# Altium schematic sheet sDAC_filters_1.SchDoc
size A; SheetNumber: 22; SheetTotal: 24
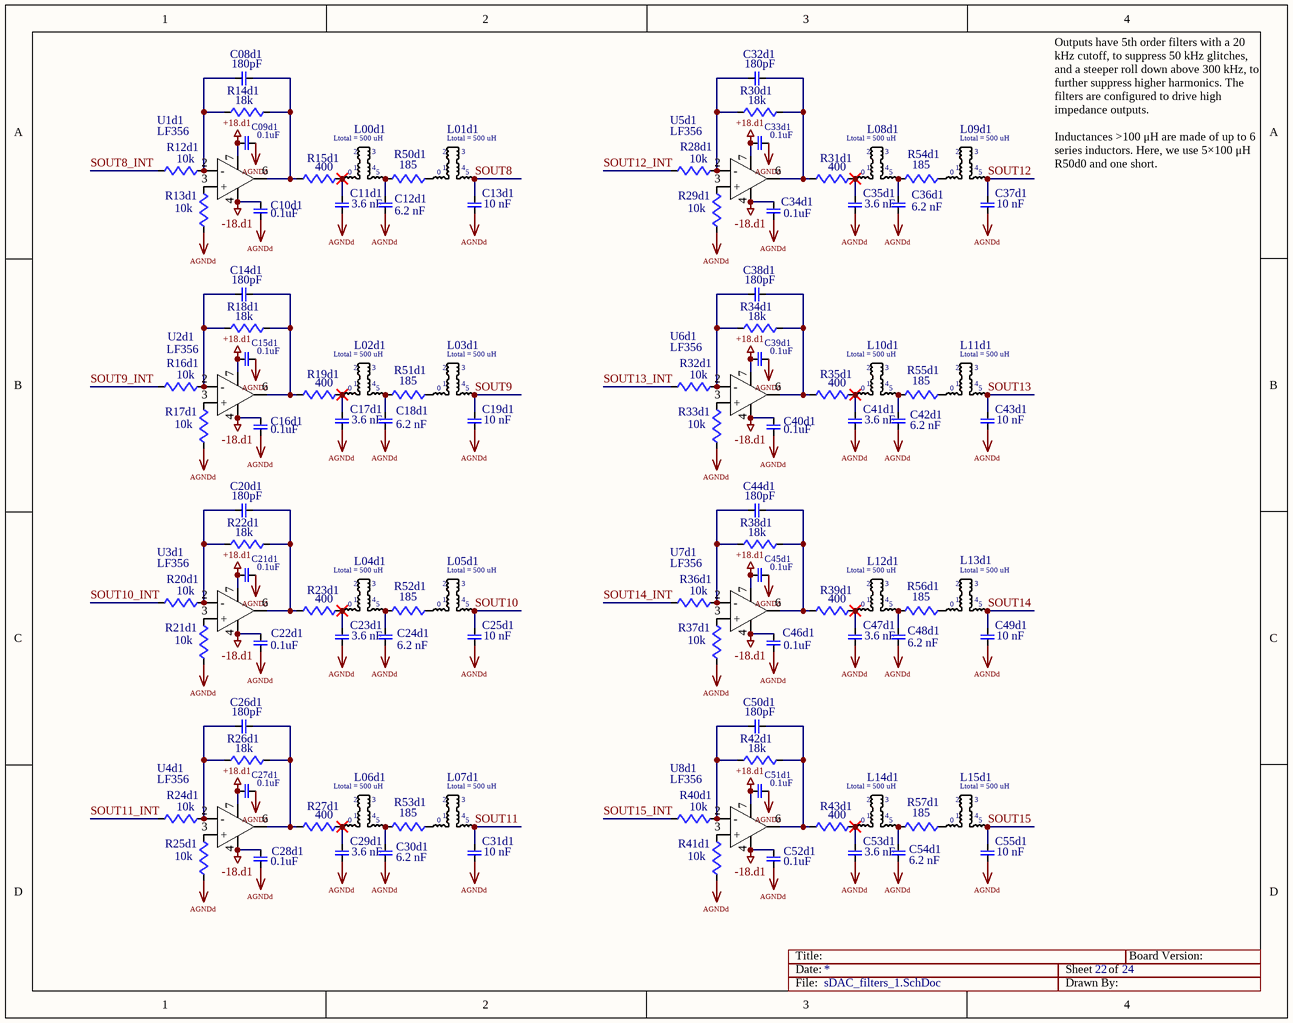
[diagram p0: sDAC_filters_1.SchDoc]

## Parts
C08d1  180pF  [0603]
C09d1  0.1uF  [0603]
C10d1  0.1uF  [0603]
C11d1  3.6 nF  [0603]
C12d1  6.2 nF  [0603]
C13d1  10 nF  [0603]
C14d1  180pF  [0603]
C15d1  0.1uF  [0603]
C16d1  0.1uF  [0603]
C17d1  3.6 nF  [0603]
C18d1  6.2 nF  [0603]
C19d1  10 nF  [0603]
C20d1  180pF  [0603]
C21d1  0.1uF  [0603]
C22d1  0.1uF  [0603]
C23d1  3.6 nF  [0603]
C24d1  6.2 nF  [0603]
C25d1  10 nF  [0603]
C26d1  180pF  [0603]
C27d1  0.1uF  [0603]
C28d1  0.1uF  [0603]
C29d1  3.6 nF  [0603]
C30d1  6.2 nF  [0603]
C31d1  10 nF  [0603]
C32d1  180pF  [0603]
C33d1  0.1uF  [0603]
C34d1  0.1uF  [0603]
C35d1  3.6 nF  [0603]
C36d1  6.2 nF  [0603]
C37d1  10 nF  [0603]
C38d1  180pF  [0603]
C39d1  0.1uF  [0603]
C40d1  0.1uF  [0603]
C41d1  3.6 nF  [0603]
C42d1  6.2 nF  [0603]
C43d1  10 nF  [0603]
C44d1  180pF  [0603]
C45d1  0.1uF  [0603]
C46d1  0.1uF  [0603]
C47d1  3.6 nF  [0603]
C48d1  6.2 nF  [0603]
C49d1  10 nF  [0603]
C50d1  180pF  [0603]
C51d1  0.1uF  [0603]
C52d1  0.1uF  [0603]
C53d1  3.6 nF  [0603]
C54d1  6.2 nF  [0603]
C55d1  10 nF  [0603]
L00d1  Ltotal = 500 uH  [SMT_TOROID_2SIDE]
L01d1  Ltotal = 500 uH  [SMT_TOROID_2SIDE]
L02d1  Ltotal = 500 uH  [SMT_TOROID_2SIDE]
L03d1  Ltotal = 500 uH  [SMT_TOROID_2SIDE]
L04d1  Ltotal = 500 uH  [SMT_TOROID_2SIDE]
L05d1  Ltotal = 500 uH  [SMT_TOROID_2SIDE]
L06d1  Ltotal = 500 uH  [SMT_TOROID_2SIDE]
L07d1  Ltotal = 500 uH  [SMT_TOROID_2SIDE]
L08d1  Ltotal = 500 uH  [SMT_TOROID_2SIDE]
L09d1  Ltotal = 500 uH  [SMT_TOROID_2SIDE]
L10d1  Ltotal = 500 uH  [SMT_TOROID_2SIDE]
L11d1  Ltotal = 500 uH  [SMT_TOROID_2SIDE]
L12d1  Ltotal = 500 uH  [SMT_TOROID_2SIDE]
L13d1  Ltotal = 500 uH  [SMT_TOROID_2SIDE]
L14d1  Ltotal = 500 uH  [SMT_TOROID_2SIDE]
L15d1  Ltotal = 500 uH  [SMT_TOROID_2SIDE]
R12d1  10k  [0603]
R13d1  10k  [0603]
R14d1  18k  [0603]
R15d1  400  [0603]
R16d1  10k  [0603]
R17d1  10k  [0603]
R18d1  18k  [0603]
R19d1  400  [0603]
R20d1  10k  [0603]
R21d1  10k  [0603]
R22d1  18k  [0603]
R23d1  400  [0603]
R24d1  10k  [0603]
R25d1  10k  [0603]
R26d1  18k  [0603]
R27d1  400  [0603]
R28d1  10k  [0603]
R29d1  10k  [0603]
R30d1  18k  [0603]
R31d1  400  [0603]
R32d1  10k  [0603]
R33d1  10k  [0603]
R34d1  18k  [0603]
R35d1  400  [0603]
R36d1  10k  [0603]
R37d1  10k  [0603]
R38d1  18k  [0603]
R39d1  400  [0603]
R40d1  10k  [0603]
R41d1  10k  [0603]
R42d1  18k  [0603]
R43d1  400  [0603]
R50d1  185  [0603]
R51d1  185  [0603]
R52d1  185  [0603]
R53d1  185  [0603]
R54d1  185  [0603]
R55d1  185  [0603]
R56d1  185  [0603]
R57d1  185  [0603]
U1d1  LF356  [8SOIC]
U2d1  LF356  [8SOIC]
U3d1  LF356  [8SOIC]
U4d1  LF356  [8SOIC]
U5d1  LF356  [8SOIC]
U6d1  LF356  [8SOIC]
U7d1  LF356  [8SOIC]
U8d1  LF356  [8SOIC]

## Nets
+18.d1: C09d1.1 C15d1.1 C21d1.1 C27d1.1 C33d1.1 C39d1.1 C45d1.1 C51d1.1 U1d1.7(V+) U2d1.7(V+) U3d1.7(V+) U4d1.7(V+) U5d1.7(V+) U6d1.7(V+) U7d1.7(V+) U8d1.7(V+)
-18.d1: C10d1.1 C16d1.1 C22d1.1 C28d1.1 C34d1.1 C40d1.1 C46d1.1 C52d1.1 U1d1.4(V-) U2d1.4(V-) U3d1.4(V-) U4d1.4(V-) U5d1.4(V-) U6d1.4(V-) U7d1.4(V-) U8d1.4(V-)
AGNDd: C09d1.2 C10d1.2 C11d1.2 C12d1.2 C13d1.2 C15d1.2 C16d1.2 C17d1.2 C18d1.2 C19d1.2 C21d1.2 C22d1.2 C23d1.2 C24d1.2 C25d1.2 C27d1.2 C28d1.2 C29d1.2 C30d1.2 C31d1.2 C33d1.2 C34d1.2 C35d1.2 C36d1.2 C37d1.2 C39d1.2 C40d1.2 C41d1.2 C42d1.2 C43d1.2 C45d1.2 C46d1.2 C47d1.2 C48d1.2 C49d1.2 C51d1.2 C52d1.2 C53d1.2 C54d1.2 C55d1.2 R13d1.1 R17d1.1 R21d1.1 R25d1.1 R29d1.1 R33d1.1 R37d1.1 R41d1.1
SOUT8: C13d1.1 L01d1.7
SOUT8_INT: R12d1.1
SOUT9: C19d1.1 L03d1.7
SOUT9_INT: R16d1.1
SOUT10: C25d1.1 L05d1.7
SOUT10_INT: R20d1.1
SOUT11: C31d1.1 L07d1.7
SOUT11_INT: R24d1.1
SOUT12: C37d1.1 L09d1.7
SOUT12_INT: R28d1.1
SOUT13: C43d1.1 L11d1.7
SOUT13_INT: R32d1.1
SOUT14: C49d1.1 L13d1.7
SOUT14_INT: R36d1.1
SOUT15: C55d1.1 L15d1.7
SOUT15_INT: R40d1.1
NetC08d1_1: C08d1.1 R14d1.2 R15d1.1 U1d1.6(OUT)
NetC08d1_2: C08d1.2 R12d1.2 R14d1.1 U1d1.2(-)
NetC11d1_1: C11d1.1 L00d1.1 R15d1.2
NetC12d1_1: C12d1.1 L00d1.7 R50d1.1
NetC14d1_1: C14d1.1 R18d1.2 R19d1.1 U2d1.6(OUT)
NetC14d1_2: C14d1.2 R16d1.2 R18d1.1 U2d1.2(-)
NetC17d1_1: C17d1.1 L02d1.1 R19d1.2
NetC18d1_1: C18d1.1 L02d1.7 R51d1.1
NetC20d1_1: C20d1.1 R22d1.2 R23d1.1 U3d1.6(OUT)
NetC20d1_2: C20d1.2 R20d1.2 R22d1.1 U3d1.2(-)
NetC23d1_1: C23d1.1 L04d1.1 R23d1.2
NetC24d1_1: C24d1.1 L04d1.7 R52d1.1
NetC26d1_1: C26d1.1 R26d1.2 R27d1.1 U4d1.6(OUT)
NetC26d1_2: C26d1.2 R24d1.2 R26d1.1 U4d1.2(-)
NetC29d1_1: C29d1.1 L06d1.1 R27d1.2
NetC30d1_1: C30d1.1 L06d1.7 R53d1.1
NetC32d1_1: C32d1.1 R30d1.2 R31d1.1 U5d1.6(OUT)
NetC32d1_2: C32d1.2 R28d1.2 R30d1.1 U5d1.2(-)
NetC35d1_1: C35d1.1 L08d1.1 R31d1.2
NetC36d1_1: C36d1.1 L08d1.7 R54d1.1
NetC38d1_1: C38d1.1 R34d1.2 R35d1.1 U6d1.6(OUT)
NetC38d1_2: C38d1.2 R32d1.2 R34d1.1 U6d1.2(-)
NetC41d1_1: C41d1.1 L10d1.1 R35d1.2
NetC42d1_1: C42d1.1 L10d1.7 R55d1.1
NetC44d1_1: C44d1.1 R38d1.2 R39d1.1 U7d1.6(OUT)
NetC44d1_2: C44d1.2 R36d1.2 R38d1.1 U7d1.2(-)
NetC47d1_1: C47d1.1 L12d1.1 R39d1.2
NetC48d1_1: C48d1.1 L12d1.7 R56d1.1
NetC50d1_1: C50d1.1 R42d1.2 R43d1.1 U8d1.6(OUT)
NetC50d1_2: C50d1.2 R40d1.2 R42d1.1 U8d1.2(-)
NetC53d1_1: C53d1.1 L14d1.1 R43d1.2
NetC54d1_1: C54d1.1 L14d1.7 R57d1.1
NetL01d1_1: L01d1.1 R50d1.2
NetL03d1_1: L03d1.1 R51d1.2
NetL05d1_1: L05d1.1 R52d1.2
NetL07d1_1: L07d1.1 R53d1.2
NetL09d1_1: L09d1.1 R54d1.2
NetL11d1_1: L11d1.1 R55d1.2
NetL13d1_1: L13d1.1 R56d1.2
NetL15d1_1: L15d1.1 R57d1.2
NetR13d1_2: R13d1.2 U1d1.3(+)
NetR17d1_2: R17d1.2 U2d1.3(+)
NetR21d1_2: R21d1.2 U3d1.3(+)
NetR25d1_2: R25d1.2 U4d1.3(+)
NetR29d1_2: R29d1.2 U5d1.3(+)
NetR33d1_2: R33d1.2 U6d1.3(+)
NetR37d1_2: R37d1.2 U7d1.3(+)
NetR41d1_2: R41d1.2 U8d1.3(+)

Not connected (* = marked no-connect by the designer): L00d1 2 3 4 5 6; L01d1 2 3 4 5 6; L02d1 2 3 4 5 6; L03d1 2 3 4 5 6; L04d1 2 3 4 5 6; L05d1 2 3 4 5 6; L06d1 2 3 4 5 6; L07d1 2 3 4 5 6; L08d1 2 3 4 5 6; L09d1 2 3 4 5 6; L10d1 2 3 4 5 6; L11d1 2 3 4 5 6; L12d1 2 3 4 5 6; L13d1 2 3 4 5 6; L14d1 2 3 4 5 6; L15d1 2 3 4 5 6

## Notes on the sheet
- Outputs have 5th order filters with a 20 kHz cutoff, to suppress 50 kHz glitches, and a steeper roll down above 300 kHz, to further suppress higher harmonics. The filters are configured to drive high impedance outputs.
  Inductances >100 μH are made of up to 6 series inductors. Here, we use 5×100 μH R50d0 and one short.
- Title:
- Date:
- Sheet
- of
- Board Version:
- File:
- Drawn By:
- Title
- Size:
- A3
- Number:
- Time:
- Revision:
- (in symbol SMT_TOROID_2SIDE) 0

## Library data of the parts
C08d1 C09d1 C10d1 C11d1 C12d1 C13d1 C14d1 C15d1 C16d1 C17d1 C18d1 C19d1 C20d1 C21d1 C22d1 C23d1 C24d1 C25d1 C26d1 C27d1 C28d1 C29d1 C30d1 C31d1 C32d1 C33d1 C34d1 C35d1 C36d1 C37d1 C38d1 C39d1 C40d1 C41d1 C42d1 C43d1 C44d1 C45d1 C46d1 C47d1 C48d1 C49d1 C50d1 C51d1 C52d1 C53d1 C54d1 C55d1 = CAP
L00d1 L01d1 L02d1 L03d1 L04d1 L05d1 L06d1 L07d1 L08d1 L09d1 L10d1 L11d1 L12d1 L13d1 L14d1 L15d1 = SMT_TOROID_2SIDE
R12d1 R13d1 R14d1 R15d1 R16d1 R17d1 R18d1 R19d1 R20d1 R21d1 R22d1 R23d1 R24d1 R25d1 R26d1 R27d1 R28d1 R29d1 R30d1 R31d1 R32d1 R33d1 R34d1 R35d1 R36d1 R37d1 R38d1 R39d1 R40d1 R41d1 R42d1 R43d1 R50d1 R51d1 R52d1 R53d1 R54d1 R55d1 R56d1 R57d1 = RES